# EAGLE design modulator (EAGLE 7.7.0)
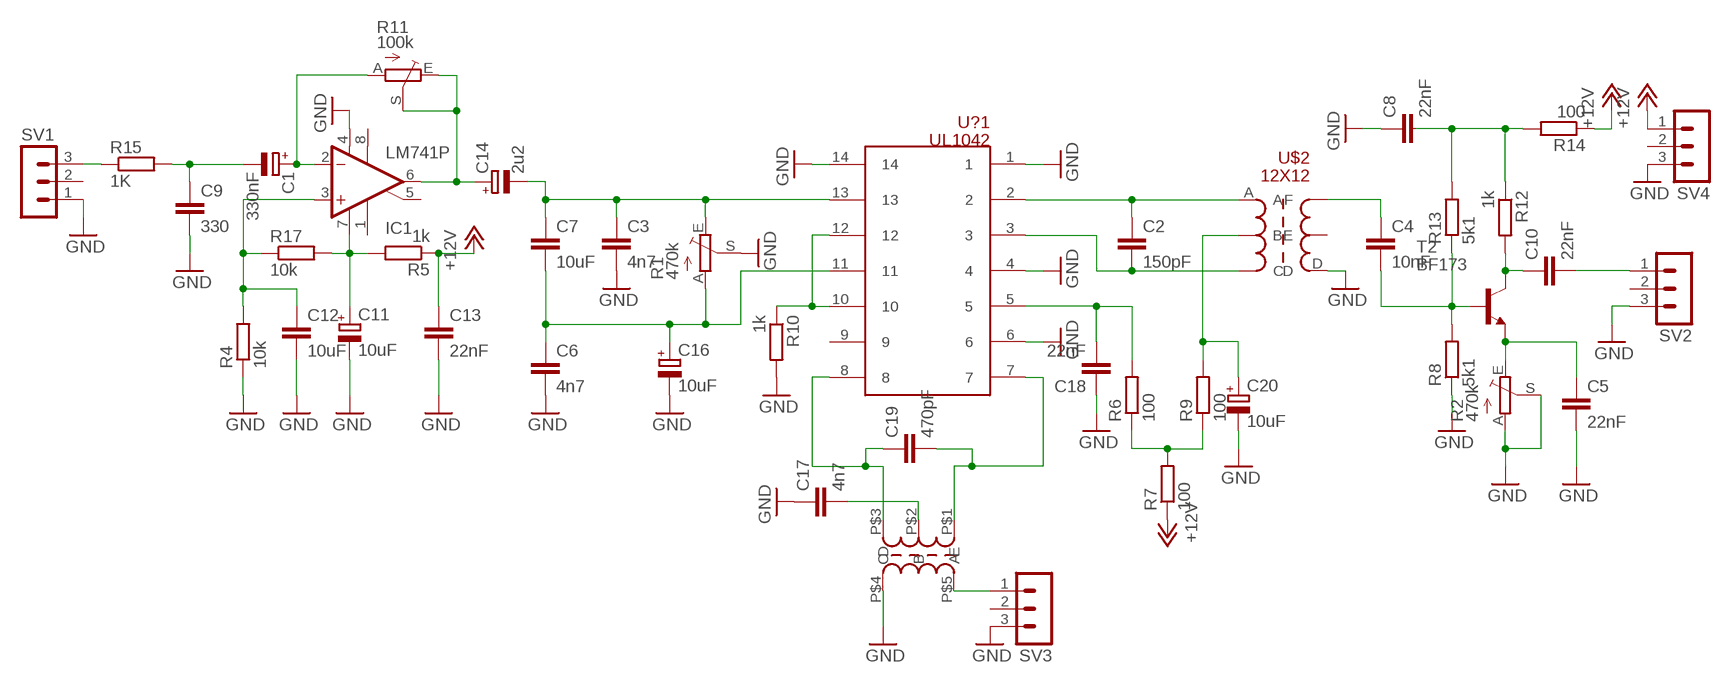
[diagram p0: schematic, sheet 1]

## Parts
C1  330nF  CPOL-EUE2.5-5  [E2,5-5]
C2  150pF  C-EU050-025X075  [C050-025X075]
C3  4n7  C-EU050-025X075  [C050-025X075]
C4  10nF  C-EU050-025X075  [C050-025X075]
C5  22nF  C-EU050-025X075  [C050-025X075]
C6  4n7  C-EU050-025X075  [C050-025X075]
C7  10uF  C-EU050-025X075  [C050-025X075]
C8  22nF  C-EU050-025X075  [C050-025X075]
C9  330  C-EU050-025X075  [C050-025X075]
C10  22nF  C-EU050-025X075  [C050-025X075]
C11  10uF  CPOL-EUE2.5-5  [E2,5-5]
C12  10uF  C-EU050-025X075  [C050-025X075]
C13  22nF  C-EU050-025X075  [C050-025X075]
C14  2u2  CPOL-EUE2.5-5  [E2,5-5]
C16  10uF  CPOL-EUE2.5-5  [E2,5-5]
C17  4n7  C-EU050-025X075  [C050-025X075]
C18  22nF  C-EU050-025X075  [C050-025X075]
C19  470pF  C-EU050-025X075  [C050-025X075]
C20  10uF  CPOL-EUE2.5-5  [E2,5-5]
IC1  LM741P  [DIL08]
R1  470k  TRIM_EU-S64Y  [S64Y]
R2  470k  TRIM_EU-CA6V  [CA6V]
R4  10k  R-EU_0204/7  [0204/7]
R5  1k  R-EU_0204/7  [0204/7]
R6  100  R-EU_0204/7  [0204/7]
R7  100  R-EU_0204/7  [0204/7]
R8  5k1  R-EU_0204/7  [0204/7]
R9  100  R-EU_0204/7  [0204/7]
R10  1k  R-EU_0204/7  [0204/7]
R11  100k  TRIM_EU-CA6V  [CA6V]
R12  1k  R-EU_0204/7  [0204/7]
R13  5k1  R-EU_0204/7  [0204/7]
R14  100  R-EU_0204/7  [0204/7]
R15  1K  R-EU_0204/7  [0204/7]
R17  10k  R-EU_0204/7  [0204/7]
SV1  MA03-1  [MA03-1]
SV2  MA03-1  [MA03-1]
SV3  MA03-1  [MA03-1]
SV4  MA03-1  [MA03-1]
T2  BF173  [TO72]
U$2  12X12  [12X12]
U$3  TR5X5  [TR5X5]
U?1  UL1042  [DIL14]

## Nets
+12V: C13.1 R5.1 R7.1 R14.1 SV4.1
GND: C3.2 C5.2 C6.2 C8.1 C9.2 C11.- C12.2 C13.2 C16.- C17.1 C18.1 C20.- IC1.4(V-) R1.S R2.A R2.S R4.1 R8.1 R10.2 SV1.1 SV2.3 SV3.3 SV4.3 U$2.D U$3.P$4(D) U?1.1 U?1.4 U?1.6 U?1.14
N$1: C1.+ IC1.2(-IN) R11.A
N$2: C12.1 IC1.3(+IN) R4.2 R17.1
N$3: C1.- C9.1 R15.2
N$4: C11.+ IC1.7(V+) R5.2 R17.2
N$5: C3.1 C7.1 C14.- R1.E U?1.13
N$6: C14.+ IC1.6(OUT) R11.E R11.S
N$7: R10.1 U?1.10 U?1.12
N$8: C6.1 C7.2 C16.+ R1.A U?1.11
N$9: C2.1 U$2.A U?1.2
N$10: C2.2 U$2.C U?1.3
N$11: C18.2 R6.2 U?1.5
N$12: C17.2 U$3.P$2(B)
N$13: C4.2 R8.2 R13.1 T2.3(B)
N$14: C8.2 R12.1 R13.2 R14.2
N$15: C19.1 U$3.P$3(C) U?1.8
N$16: C19.2 U$3.P$1(A) U?1.7
N$18: C10.1 R12.2 T2.2(C)
N$19: R6.1 R7.2 R9.1
N$20: C5.1 R2.E T2.4(E)
N$21: C20.+ R9.2 U$2.B
N$22: SV3.1 U$3.P$5(E)
N$23: C10.2 SV2.1
N$24: R15.1 SV1.3
N$25: C4.1 U$2.G(F)
Unconnected: IC1.1(ON1) IC1.5(ON2) IC1.8(OPT) SV1.2 SV2.2 SV3.2 SV4.2 U$2.E U?1.9

## Power pins joined to a net without a drawn wire
GND: U$2.GND1(GND) U$2.GND2(GND)

## Library data of the parts
C1 C11 C14 C16 C20 = rcl:CPOL-EU: POLARIZED CAPACITOR, European symbol
C2-C10 C12 C13 C17-C19 = rcl:C-EU: CAPACITOR, European symbol
IC1 = linear:*741: OP AMP
R1 R2 R11 = pot:TRIM_EU-: POTENTIOMETER
R4-R10 R12-R15 R17 = resistor:R-EU_: RESISTOR, European symbol
SV1-SV4 = con-lstb:MA03-1: PIN HEADER; OC_FARNELL: unknown; OC_NEWARK: unknown
T2 = sp5ww:BF173
U$2 = sp5ww:12X12
U$3 = sp5ww:TR5X5
U?1 = sp5ww:UL1042

## Board
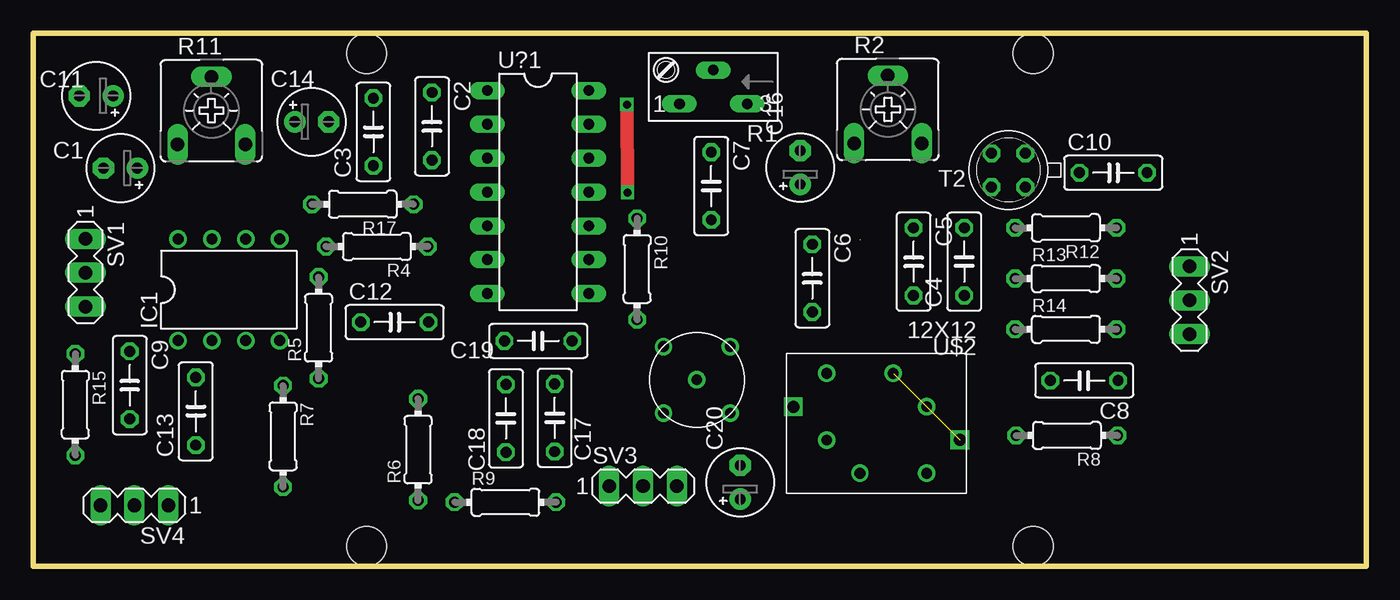
[diagram p1: board, top side]
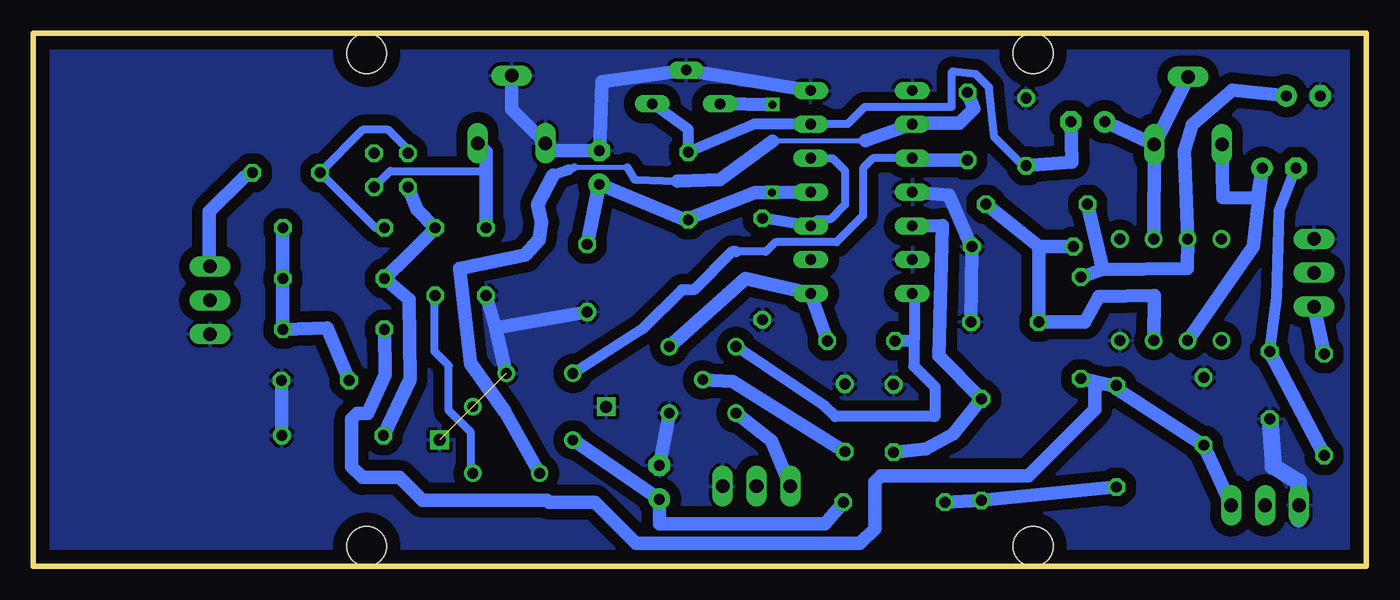
[diagram p2: board, bottom side, seen from below]

Size 100 x 40 mm. Coordinates in mm from the lower left corner, seen from the top.
Outline: 0,0 100,0 100,40 0,40 0,0
Copper layers (1*16): Top 0.035mm / dielectric 1.5mm / Bottom 0.035mm
Design rules "default": minimum track width 10mil, minimum drill 24mil, track to track 8mil, track to pad 8mil, pad to pad 8mil, via to via 8mil, smd to smd 8mil, copper to edge 40mil, drill to drill 8mil, minimum pad ring 10mil, minimum via ring 8mil, stop-mask expansion 4mil, vias tented up to drill 0mil, thermal gap 10mil
Holes 3 mm at 25,38.5 25,1.5 75,38.5 75,1.5

### Footprints (pad centres in the part's own frame; a part is rotated, then mirrored left to right if it is on the bottom)
E2,5-5 = drill 0.813 pad 1.6: + -1.27,0 | drill 0.813 pad 1.6 octagon: - 1.27,0
C050-025X075 = drill 0.813 octagon: 1 -2.54,0; 2 2.54,0
DIL08 = drill 0.813 pad 1.27: 1 -3.81,-3.81; 2 -1.27,-3.81; 3 1.27,-3.81; 4 3.81,-3.81; 5 3.81,3.81; 6 1.27,3.81; 7 -1.27,3.81; 8 -3.81,3.81
S64Y = drill 0.813 long: A 2.54,1.27; E -2.54,1.27; S 0,-1.27
CA6V = drill 1.016 long: A -2.54,-2.54; E 2.54,-2.54; S 0,2.54
0204/7 = drill 0.813 octagon: 1 -3.81,0; 2 3.81,0
MA03-1 = drill 1.016 long: 1 -2.54,0; 2 0,0; 3 2.54,0
TO72 = drill 0.813 octagon: 1 -1.27,-1.27; 2 1.27,-1.27; 3 1.27,1.27; 4 -1.27,1.27
12X12 = drill 0.8: A 7.5,2.5; B 10,0; C 10,-5; D 5,-5; E 2.5,-2.5; G 2.5,2.5 | drill 0.9 square: GND1 0,0; GND2 12.5,-2.5
TR5X5 = drill 0.8: P$1 0,0; P$2 2.5,2.5; P$3 0,5; P$4 5,5; P$5 5,0
DIL14 = drill 0.813 long: 1 -7.62,-3.81; 2 -5.08,-3.81; 3 -2.54,-3.81; 4 0,-3.81; 5 2.54,-3.81; 6 5.08,-3.81; 7 7.62,-3.81; 8 7.62,3.81; 9 5.08,3.81; 10 2.54,3.81; 11 0,3.81; 12 -2.54,3.81; 13 -5.08,3.81; 14 -7.62,3.81

### Placement (x,y rotation side)
C1  6.53,29.88 180 top
C2  29.91,33.02 270 top
C3  25.52,32.6 90 top
C4  69.85,22.86 90 top
C5  66.04,22.86 270 top
C6  58.45,21.62 270 top
C7  50.86,28.54 270 top
C8  78.85,13.94 180 top
C9  7.23,13.59 270 top
C10  81.03,29.54 0 top
C11  4.72,35.31 180 top
C12  27.11,18.32 0 top
C13  12.19,11.63 90 top
C14  20.88,33.36 0 top
C16  57.54,29.93 90 top
C17  39.12,11.14 270 top
C18  35.46,11.09 270 top
C19  37.89,16.91 180 top
C20  53.03,6.3 90 top
IC1  14.67,20.75 0 top
R1  51.02,35.97 180 top
R2  64.11,34.29 0 top
R4  25.77,24 180 top
R5  21.41,17.89 90 top
R6  28.87,8.75 90 top
R7  18.74,9.75 270 top
R8  77.55,9.81 180 top
R9  35.42,4.8 0 top
R10  45.3,22.31 270 top
R11  13.36,34.19 0 top
R12  77.47,25.4 180 top
R13  77.47,21.59 0 top
R14  77.47,17.78 0 top
R15  3.15,12.13 270 top
R17  24.72,27.17 180 top
SV1  3.91,22.03 270 top
SV2  86.75,19.96 270 top
SV3  45.74,6.01 0 top
SV4  7.58,4.57 180 top
T2  73.16,29.73 180 top
U$2  69.52,9.47 180 top
U$3  47.28,16.49 270 top
U?1  37.87,28.09 270 top

### Tracks (layer width: path | path; a pad name or v marks a point on that pad's centre or on a via)
+12V
  Bottom 1.016: 19.11,13.58 R5.1 19.99,13.7 20.37,13.32 20.37,11.78 25.36,6.79 36.4,6.79 36.87,6.32 36.87,2.82 37.98,1.71 54.77,1.71 57.87,4.8 61.3,4.8 61.45,4.95 70.81,4.95 72.51,6.65 75.3,6.65 76.11,7.46 76.11,11.06 75.7,11.47 74.93,11.47 73.62,14.35 R14.1 | 19.11,13.58 R7.1 | SV4.1 C13.1 19.11,13.58
GND  (1 unrouted)
  Bottom 1.016: R2.S 64.11,34.29 R2.A 61.02,31.2 C16.- 57.34,36.36 R1.S U?1.14 | R8.1 C8.1 | C5.2 65.31,17.9 | 65.31,17.9 U$2.D | C6.2 65.31,17.9 | U?1.4 31.3,27.87 29.57,23.89 C12.2 | C20.- U$3.P$4
  Bottom 1.27: C9.2 6.98,7.49 5.08,6.35 5.08,3.54 SV4.3
  pour Bottom (isolate 0.813): 1.15,39.61 99.1,39.7 99.51,39.52 99.86,39.56 99.64,0.38 0.82,0.54 0.4,0.38 0.4,39.65
N$1
  Bottom 1.016: R11.A 10.76,27.68 8.15,27.63 C1.+ 8.48,23.99 IC1.2
N$2
  Bottom 1.016: R17.1 24.56,23.98 | 24.56,23.98 R4.2 | 24.56,23.98 C12.1 21.09,18.34 20.07,20.26 15.89,20.33 IC1.3
N$3
  Bottom 0.813: C9.1 6.72,20.19 6.53,26.68 C1.-
  Bottom 1.016: C9.1 R15.2
N$4
  Bottom 1.016: C11.+ 10.03,35.75 13.05,33.15 13.65,31.16 IC1.7 13.41,22.35 19.77,22.29 | R5.2 19.77,22.29 | 19.77,22.29 R17.2
N$5
  Bottom 0.61: C3.1 25.75,30.06 27.91,32.22 28.3,35.95 29.29,36.95 31.04,37.12 31.1,37.06 31.1,34.47 37.64,34.47 38.91,33.2 41.65,33.2 U?1.13
  Bottom 0.813: U?1.13 45.9,33.19 C7.1 50.86,32.79 R1.E
  Bottom 1.016: C14.- 22.07,30.34 C3.1
N$6
  Bottom 1.016: C14.+ R11.E | R11.E R11.S | R11.E IC1.6
N$7
  Bottom 0.61: U?1.12 40.04,30.63 39.09,29.68 39.1,29.68 39.1,27.13 40.2,26.03 41.2,26.03 U?1.10
  Bottom 0.813: U?1.10 R10.1
N$8  (via drill 0.6)
  Top 1.016: v44.53,34.66 v44.58,28.06
  Bottom 1.016: C16.+ C6.1 57.57,28.69 51.06,25.97 50.85,26.09 | 50.85,26.09 45.86,28.05 45.16,28.05 v44.58,28.06 U?1.11 | C7.2 50.85,26.09 | R1.A v44.53,34.66
N$9  (1 unrouted)
  Bottom 0.406: 59.43,29.93 55.46,29.95 | 44.56,31.92 37.57,31.93
  Bottom 0.61: 59.87,29.75 59.8,29.85 59.43,29.93 | 55.46,29.95 54.9,29.04 51.66,28.92
  Bottom 0.813: 60.99,29.37 59.87,29.75
  Bottom 1.016: C2.1 29.44,34.35 30.53,33.26 33.97,33.26 U?1.2 37.57,31.93 | U$2.A 64.62,11.58 67.19,15.22 68.01,22.33 63.11,23.34 62.06,24.51 | 62.07,24.48 61.86,25.84 62.15,27.14 60.99,29.37 | 51.66,28.92 48.49,29.01 44.56,31.92
N$10
  Bottom 0.61: U?1.3 37,30.63 37.75,29.88 37.75,26.3 39.73,24.33 44.28,24.33 44.33,24.28 44.37,24.28 45.04,23.61 47.26,23.61
  Bottom 0.813: 47.26,23.61 47.56,23.61 50.43,20.75 51.35,20.75 54.27,17.82 U$2.C
  Bottom 1.016: C2.2 33.91,30.48 U?1.3
N$11
  Bottom 1.016: U?1.5 31.79,25.58 32.05,15.8 R6.2 30.98,9.94 33.04,8.81 C18.2
N$12
  Bottom 1.016: U$3.P$2 47.55,13.86 C17.2
N$13
  Bottom 1.016: T2.3 71.21,26.76 C4.2 69.85,25.35 72.64,22.57 72.69,22.57 R13.1 71.79,20.03 71.75,14 R8.2
N$14
  Bottom 1.016: R12.1 R13.2 R14.2 77.96,17.86 C8.2
N$15
  Bottom 1.016: U$3.P$3 46.56,21.6 U?1.8 C19.1
N$16
  Bottom 0.813: U?1.7 33.91,20.47 33.91,16.95 35.35,16.95 C19.2 33.93,16.91 33.93,15.02 32.35,13.44 32.35,11.25 32.37,11.23 39.83,11.23 40.64,12.04 U$3.P$1
N$18
  Bottom 0.61: T2.2 71.89,31.28 73.36,32.75 75.28,32.75 C10.1 76.51,27.56 76.49,27.56 74.33,25.4 R12.2
N$19
  Bottom 1.016: R9.1 R6.1 R7.2
N$20
  Bottom 0.61: T2.4 74.42,28.46 73.22,29.66 66.08,29.66 66.04,29.62
  Bottom 1.016: C5.1 66.04,29.62 66.04,31.14 R2.E
N$21
  Bottom 1.016: R9.2 40.59,3.19 53.02,3.17 C20.+ U$2.B
N$22
  Bottom 1.016: U$3.P$5 44.61,9.4 SV3.1
N$23
  Bottom 1.016: C10.2 84.19,29.21 86.79,26.61 86.79,22.54 SV2.1
N$24
  Bottom 1.016: R15.1 SV1.3
N$25
  Bottom 0.61: U$2.G 67.17,7.13 67.17,10.03 68.84,11.69 68.84,15.07 69.9,16.13 69.9,20.27 C4.1